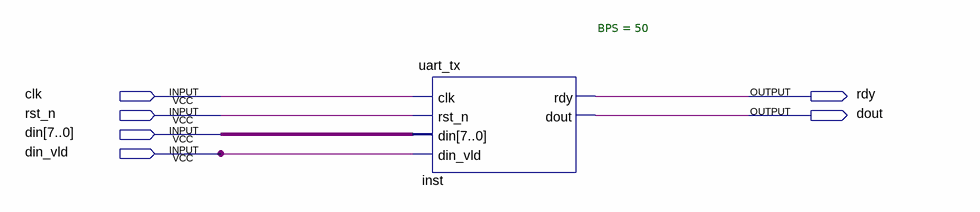
[diagram p0: schematic sheet]
// Quartus schematic uart_tx_tst.bdf as structural Verilog: 1 symbols, 6 pins
module uart_tx_tst (
  input  clk,
  input  rst_n,
  input  [7:0] din,
  input  din_vld,
  output rdy,
  output dout
);

  uart_tx #(.BPS(50)) inst (.clk(clk), .rst_n(rst_n), .din(din), .din_vld(din_vld), .rdy(rdy), .dout(dout));
endmodule
